# Altium schematic sheet other.SchDoc
size 297 x 209 mm
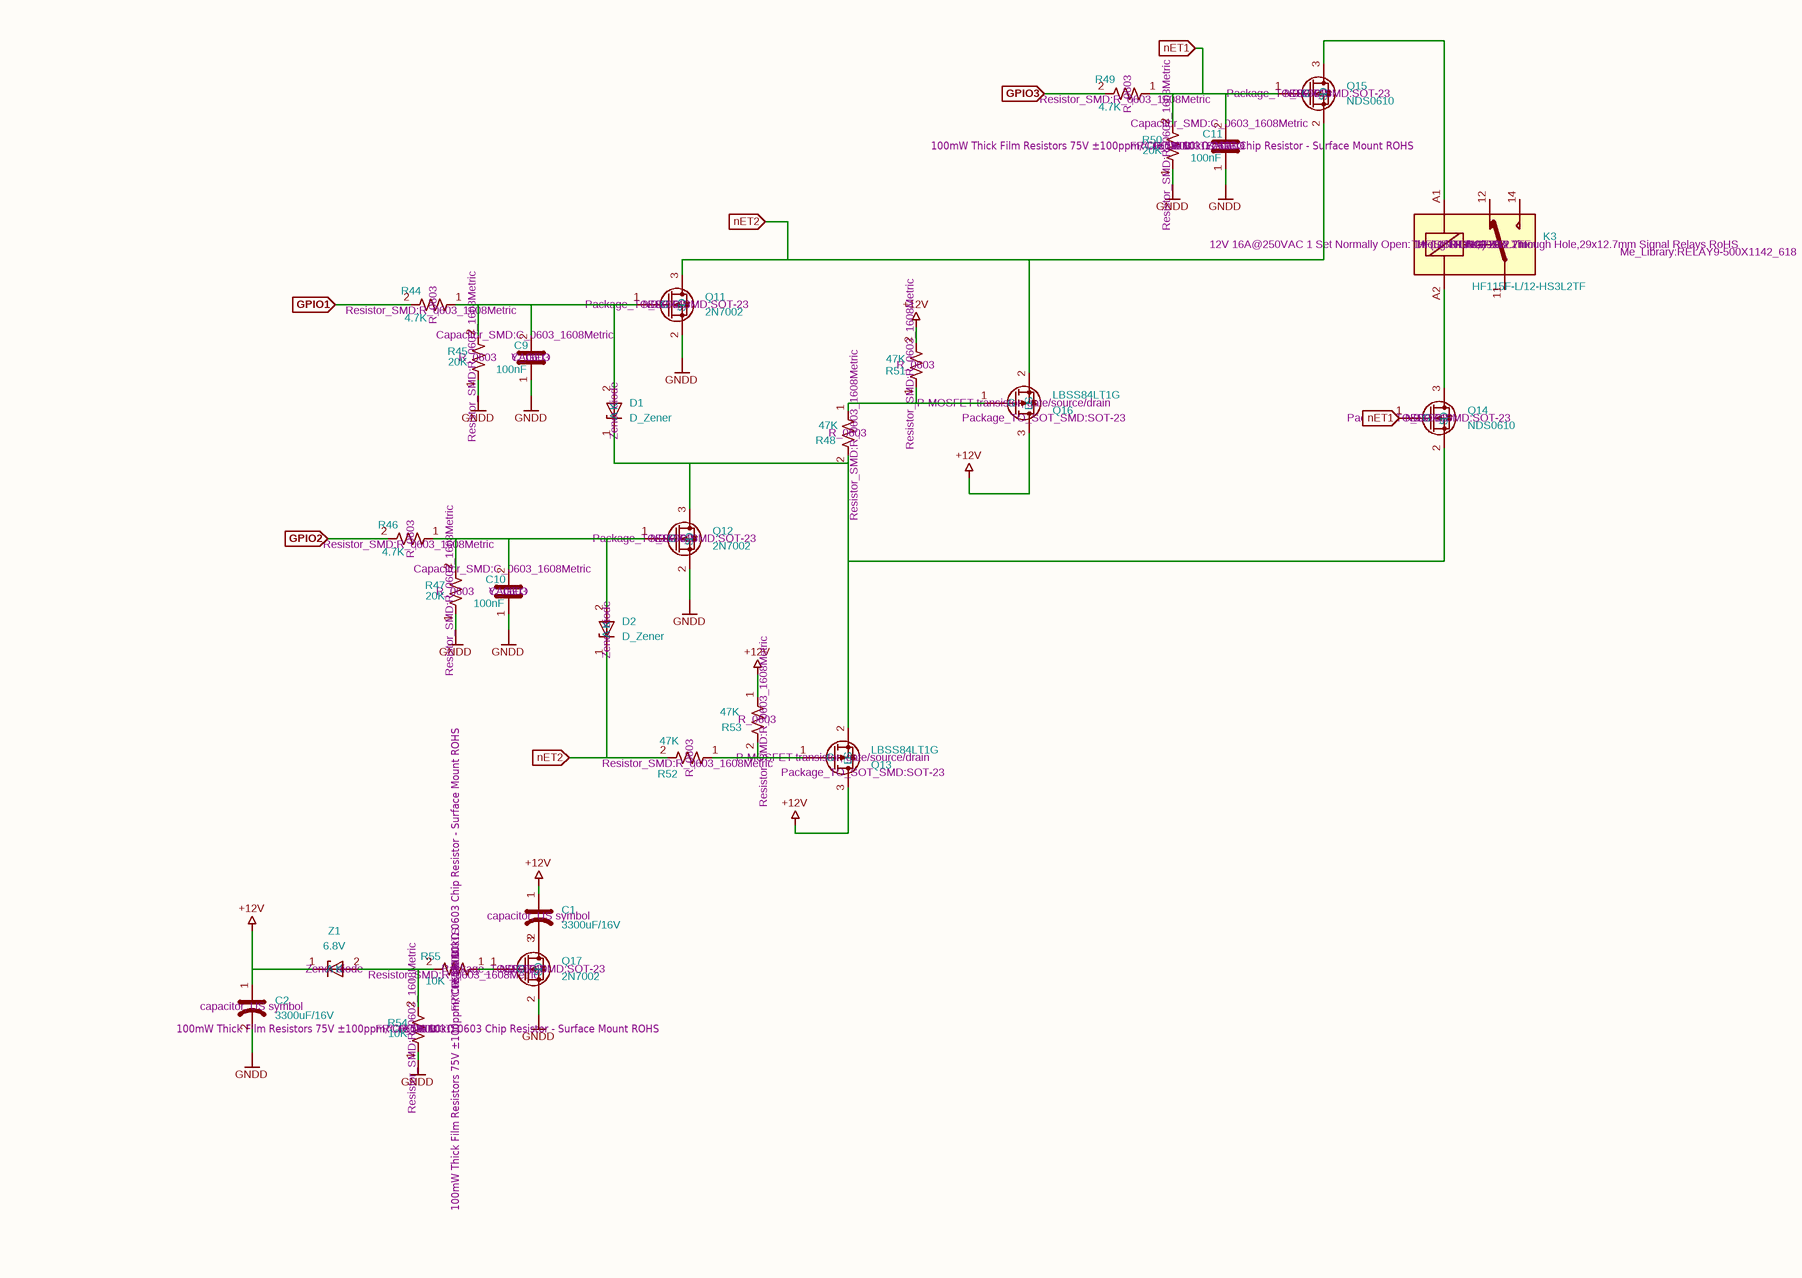
[diagram p0: other.SchDoc, left]
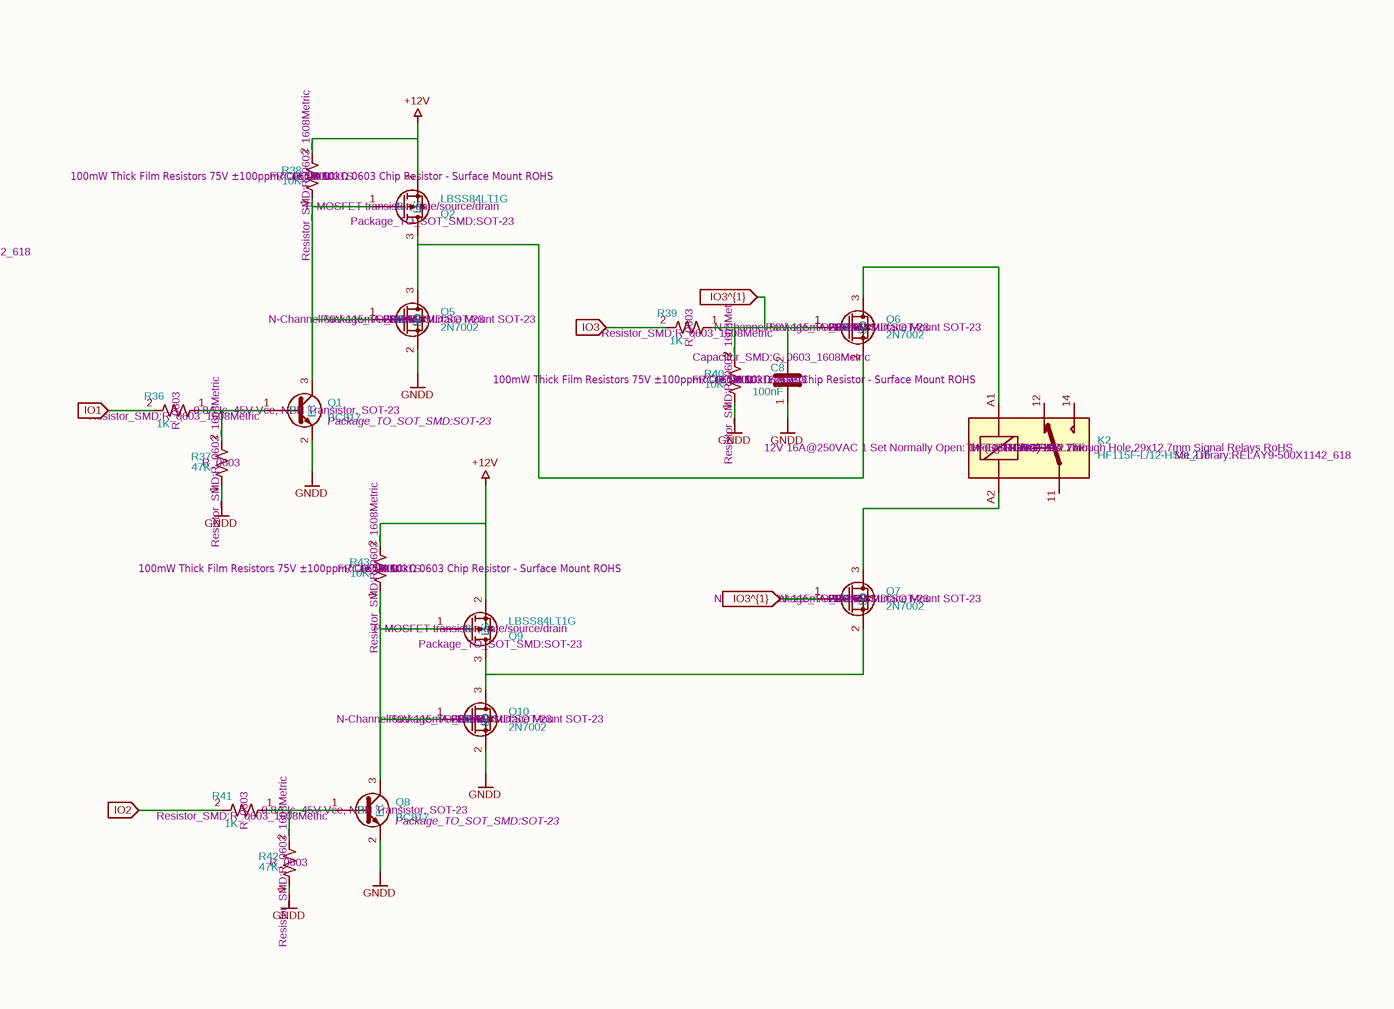
[diagram p1: other.SchDoc, right]

## Parts
C1  Description: capacitor, US symbol  (hidden comment: 3300uF/16V)
C2  Description: capacitor, US symbol  (hidden comment: 3300uF/16V)
C8  MF: YAGEO  Package: C_0603  Footprint: Capacitor_SMD:C_0603_1608Metric  [C_0603_1608Metric]  (hidden comment: 100nF)
C9  MF: YAGEO  Package: C_0603  Footprint: Capacitor_SMD:C_0603_1608Metric  [C_0603_1608Metric]  (hidden comment: 100nF)
C10  MF: YAGEO  Package: C_0603  Footprint: Capacitor_SMD:C_0603_1608Metric  [C_0603_1608Metric]  (hidden comment: 100nF)
C11  MF: YAGEO  Package: C_0603  Footprint: Capacitor_SMD:C_0603_1608Metric  [C_0603_1608Metric]  (hidden comment: 100nF)
D1  Description: Zener diode  (hidden comment: D_Zener)
D2  Description: Zener diode  (hidden comment: D_Zener)
K2  Description: 12V 16A@250VAC 1 Set Normally Open: 1A (SPST NO) 20A Through Hole,29x12.7mm Signal Relays RoHS  MF: HONGFA  Package: Through Hole,29x12.7mm  OZD: RT314F12  Footprint: Me_Library:RELAY9-500X1142_618  [RELAY9-500X1142_618]  (hidden comment: HF115F-L/12-HS3L2TF)
K3  Description: 12V 16A@250VAC 1 Set Normally Open: 1A (SPST NO) 20A Through Hole,29x12.7mm Signal Relays RoHS  MF: HONGFA  Package: Through Hole,29x12.7mm  OZD: RT314F12  Footprint: Me_Library:RELAY9-500X1142_618  [RELAY9-500X1142_618]  (hidden comment: HF115F-L/12-HS3L2TF)
Q1  Description: 0.8A Ic, 45V Vce, NPN Transistor, SOT-23  Footprint: Package_TO_SOT_SMD:SOT-23  [SOT-23]  (hidden comment: BC817)
Q2  Description: P-MOSFET transistor, gate/source/drain  Footprint: Package_TO_SOT_SMD:SOT-23  [SOT-23]  (hidden comment: LBSS84LT1G)
Q5  Description: N-Channel 60V 115mA 225mW Surface Mount SOT-23  MF: FOSAN  Footprint: Package_TO_SOT_SMD:SOT-23  [SOT-23]  (hidden comment: 2N7002)
Q6  Description: N-Channel 60V 115mA 225mW Surface Mount SOT-23  MF: FOSAN  Footprint: Package_TO_SOT_SMD:SOT-23  [SOT-23]  (hidden comment: 2N7002)
Q7  Description: N-Channel 60V 115mA 225mW Surface Mount SOT-23  MF: FOSAN  Footprint: Package_TO_SOT_SMD:SOT-23  [SOT-23]  (hidden comment: 2N7002)
Q8  Description: 0.8A Ic, 45V Vce, NPN Transistor, SOT-23  Footprint: Package_TO_SOT_SMD:SOT-23  [SOT-23]  (hidden comment: BC817)
Q9  Description: P-MOSFET transistor, gate/source/drain  Footprint: Package_TO_SOT_SMD:SOT-23  [SOT-23]  (hidden comment: LBSS84LT1G)
Q10  Description: N-Channel 60V 115mA 225mW Surface Mount SOT-23  MF: FOSAN  Footprint: Package_TO_SOT_SMD:SOT-23  [SOT-23]  (hidden comment: 2N7002)
Q11  MP: NDS0610  Footprint: Package_TO_SOT_SMD:SOT-23  [SOT-23]  (hidden comment: 2N7002)
Q12  MP: NDS0610  Footprint: Package_TO_SOT_SMD:SOT-23  [SOT-23]  (hidden comment: 2N7002)
Q13  Description: P-MOSFET transistor, gate/source/drain  Footprint: Package_TO_SOT_SMD:SOT-23  [SOT-23]  (hidden comment: LBSS84LT1G)
Q14  Footprint: Package_TO_SOT_SMD:SOT-23  [SOT-23]  (hidden comment: NDS0610)
Q15  Footprint: Package_TO_SOT_SMD:SOT-23  [SOT-23]  (hidden comment: NDS0610)
Q16  Description: P-MOSFET transistor, gate/source/drain  Footprint: Package_TO_SOT_SMD:SOT-23  [SOT-23]  (hidden comment: LBSS84LT1G)
Q17  MP: NDS0610  Footprint: Package_TO_SOT_SMD:SOT-23  [SOT-23]  (hidden comment: 2N7002)
R36  Package: R_0603  Footprint: Resistor_SMD:R_0603_1608Metric  [R_0603_1608Metric]  (hidden comment: 1K)
R37  Package: R_0603  Footprint: Resistor_SMD:R_0603_1608Metric  [R_0603_1608Metric]  (hidden comment: 47K)
R38  Description: 100mW Thick Film Resistors 75V ±100ppm/℃ ±5% 10kΩ 0603 Chip Resistor - Surface Mount ROHS  MP: FRC0603J103TS  MF: FOJAN  Package: R_0603  Footprint: Resistor_SMD:R_0603_1608Metric  [R_0603_1608Metric]  (hidden comment: 10K)
R39  Package: R_0603  Footprint: Resistor_SMD:R_0603_1608Metric  [R_0603_1608Metric]  (hidden comment: 1K)
R40  Description: 100mW Thick Film Resistors 75V ±100ppm/℃ ±5% 10kΩ 0603 Chip Resistor - Surface Mount ROHS  MP: FRC0603J103TS  MF: FOJAN  Package: R_0603  Footprint: Resistor_SMD:R_0603_1608Metric  [R_0603_1608Metric]  (hidden comment: 10K)
R41  Package: R_0603  Footprint: Resistor_SMD:R_0603_1608Metric  [R_0603_1608Metric]  (hidden comment: 1K)
R42  Package: R_0603  Footprint: Resistor_SMD:R_0603_1608Metric  [R_0603_1608Metric]  (hidden comment: 47K)
R43  Description: 100mW Thick Film Resistors 75V ±100ppm/℃ ±5% 10kΩ 0603 Chip Resistor - Surface Mount ROHS  MP: FRC0603J103TS  MF: FOJAN  Package: R_0603  Footprint: Resistor_SMD:R_0603_1608Metric  [R_0603_1608Metric]  (hidden comment: 10K)
R44  Package: R_0603  Footprint: Resistor_SMD:R_0603_1608Metric  [R_0603_1608Metric]  (hidden comment: 4.7K)
R45  Package: R_0603  Footprint: Resistor_SMD:R_0603_1608Metric  [R_0603_1608Metric]  (hidden comment: 20K)
R46  Package: R_0603  Footprint: Resistor_SMD:R_0603_1608Metric  [R_0603_1608Metric]  (hidden comment: 4.7K)
R47  Package: R_0603  Footprint: Resistor_SMD:R_0603_1608Metric  [R_0603_1608Metric]  (hidden comment: 20K)
R48  Package: R_0603  Footprint: Resistor_SMD:R_0603_1608Metric  [R_0603_1608Metric]  (hidden comment: 47K)
R49  Package: R_0603  Footprint: Resistor_SMD:R_0603_1608Metric  [R_0603_1608Metric]  (hidden comment: 4.7K)
R50  Description: 100mW Thick Film Resistors 75V ±100ppm/℃ ±5% 10kΩ 0603 Chip Resistor - Surface Mount ROHS  MP: FRC0603J103TS  MF: FOJAN  Package: R_0603  Footprint: Resistor_SMD:R_0603_1608Metric  [R_0603_1608Metric]  (hidden comment: 20K)
R51  Package: R_0603  Footprint: Resistor_SMD:R_0603_1608Metric  [R_0603_1608Metric]  (hidden comment: 47K)
R52  Package: R_0603  Footprint: Resistor_SMD:R_0603_1608Metric  [R_0603_1608Metric]  (hidden comment: 47K)
R53  Package: R_0603  Footprint: Resistor_SMD:R_0603_1608Metric  [R_0603_1608Metric]  (hidden comment: 47K)
R54  Description: 100mW Thick Film Resistors 75V ±100ppm/℃ ±5% 10kΩ 0603 Chip Resistor - Surface Mount ROHS  MP: FRC0603J103TS  MF: FOJAN  Package: R_0603  Footprint: Resistor_SMD:R_0603_1608Metric  [R_0603_1608Metric]  (hidden comment: 10K)
R55  Description: 100mW Thick Film Resistors 75V ±100ppm/℃ ±5% 10kΩ 0603 Chip Resistor - Surface Mount ROHS  MP: FRC0603J103TS  MF: FOJAN  Package: R_0603  Footprint: Resistor_SMD:R_0603_1608Metric  [R_0603_1608Metric]  (hidden comment: 10K)
Z1  Description: Zener diode  (hidden comment: 6.8V)

## Ports
GPIO1 (in), GPIO2 (in), GPIO3 (in), IO1 (in), IO2 (in), IO3 (in), IO3^{1} (in), nET1 (in), nET2 (in)

## Nets
+12V: C1.1 C2.1 Q2.2(S) Q9.2(S) Q13.3(D) Q16.3(D) R38.2 R43.2 R51.2 R53.1 Z1.1(K)
GNDD: C2.2 C8.1 C9.1 C10.1 C11.1 Q1.2(E) Q5.2(S) Q8.2(E) Q10.2(S) Q11.2(S) Q12.2(S) Q17.2(S) R37.1 R40.1 R42.1 R45.1 R47.1 R50.1 R54.1
GPIO1: R44.2 ; port GPIO1
GPIO2: R46.2 ; port GPIO2
GPIO3: R49.2 ; port GPIO3
IO1: R36.2 ; port IO1
IO2: R41.2 ; port IO2
IO3: R39.2 ; port IO3
IO3^{1}: C8.2 Q6.1(G) Q7.1(G) R39.1 R40.2 ; port IO3^{1}
nET1: C11.2 Q14.1(G) Q15.1(G) R49.1 R50.2 ; port nET1
nET2: D2.1(K) Q11.3(D) Q15.2(S) Q16.2(S) R52.2 ; port nET2
NetC1_2: C1.2 Q17.3(D)
NetC9_2: C9.2 D1.2(A) Q11.1(G) R44.1 R45.2
NetC10_2: C10.2 D2.2(A) Q12.1(G) R46.1 R47.2
NetD1_1: D1.1(K) Q12.3(D) Q13.2(S) Q14.2(S) R48.2
NetK2_A1: K2.A1 Q6.3(D)
NetK2_A2: K2.A2 Q7.3(D)
NetK3_A1: K3.A1 Q15.3(D)
NetK3_A2: K3.A2 Q14.3(D)
NetQ1_1: Q1.1(B) R36.1 R37.2
NetQ1_3: Q1.3(C) Q2.1(G) Q5.1(G) R38.1
NetQ2_3: Q2.3(D) Q5.3(D) Q6.2(S)
NetQ7_2: Q7.2(S) Q9.3(D) Q10.3(D)
NetQ8_1: Q8.1(B) R41.1 R42.2
NetQ8_3: Q8.3(C) Q9.1(G) Q10.1(G) R43.1
NetQ13_1: Q13.1(G) R52.1 R53.2
NetQ16_1: Q16.1(G) R48.1 R51.1
NetQ17_1: Q17.1(G) R55.1
NetR54_2: R54.2 R55.2 Z1.2(A)

Not connected (* = marked no-connect by the designer): K2 11 12 14; K3 11 12 14

## Notes on the sheet
- 1
- 2
- 3
- 4
- 5
- 6
- A
- B
- C
- D
- Title:
- File: other.kicad_sch
- Sheet: /
- KiCad E.D.A.  kicad (5.1.4)-1
- Size: A4
- Date:
- Rev:
- Id: 1/1

## Library data of the parts
C1 C2 = C_US: Value: 3300uF/16V
C8-C11 = C_3: Value: 100nF
D1 = D_Zener_1: Value: D_Zener
K2 K3 = RT314A03_1: MP: HF115F-L/12-HS3L2TF; Value: HF115F-L/12-HS3L2TF
Q2 Q9 Q13 = Q_PMOS_GSD: Value: LBSS84LT1G
Q5-Q7 Q10-Q12 Q14 Q15 Q17 = Q_NMOS_Depletion_GSD: Package: SOT-23
  Q5-Q7 Q10: MP: 2N7002; Value: 2N7002
  Q11 Q12 Q17: Value: 2N7002
  Q14 Q15: MP: NDS0610; Value: NDS0610
Q16 = Q_PMOS_GSD_1: Value: LBSS84LT1G
R36-R55 = R_US
  R36 R39 R41: Value: 1K
  R37 R42 R48 R51-R53: Value: 47K
  R38 R40 R43 R54 R55: Value: 10K
  R44 R46 R49: Value: 4.7K
  R45 R47 R50: Value: 20K
Z1 = D_Zener: Value: 6.8V
D2 = D_Zener: Value: D_Zener
Q1 Q8 = BC817: Value: BC817